# Altium schematic sheet levelShifter.SchDoc
size A4; SheetNumber: 4; SheetTotal: 4
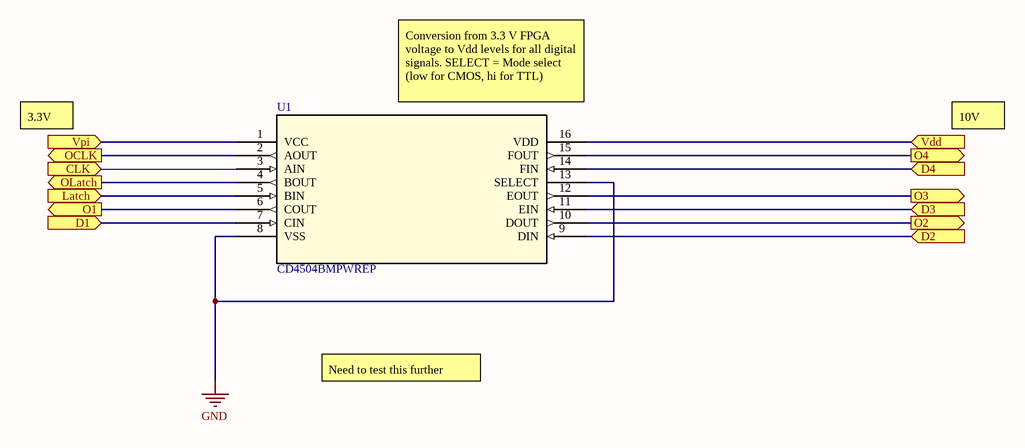
[diagram p0: levelShifter.SchDoc]

## Parts
U1  CD4504BMPWREP  [PW16]

## Ports
CLK (in), D1 (in), D2 (in), D3 (in), D4 (in), Latch (in), O1 (out), O2 (out), O3 (out), O4 (out), OCLK (out), OLatch (out), Vdd (in), Vpi (in)

## Nets
GND: U1.8(VSS) U1.13(SELECT)
CLK: U1.3(AIN) ; port CLK
D1: U1.7(CIN) ; port D1
D2: U1.9(DIN) ; port D2
D3: U1.11(EIN) ; port D3
D4: U1.14(FIN) ; port D4
Latch: U1.5(BIN) ; port Latch
O1: U1.6(COUT) ; port O1
O2: U1.10(DOUT) ; port O2
O3: U1.12(EOUT) ; port O3
O4: U1.15(FOUT) ; port O4
OCLK: U1.2(AOUT) ; port OCLK
OLatch: U1.4(BOUT) ; port OLatch
Vdd: U1.16(VDD) ; port Vdd
Vpi: U1.1(VCC) ; port Vpi

## Notes on the sheet
- 3.3V
- (near U1) Conversion from 3.3 V FPGA voltage to Vdd levels for all digital signals. SELECT = Mode select (low for CMOS, hi for TTL)
- 10V
- Need to test this further

## Library data of the parts
U1 = CD4504BMPWREP: No Description Available; Mfr_Name: Texas Instruments; Copyright: Copyright (C) 2022 Ultra Librarian. All rights reserved.; Manufacturer_Part_Number: CD4504BMPWREP; RefDes: RefDes; Type: DEV